# EAGLE design 3M_Repair (EAGLE 9.5.1)
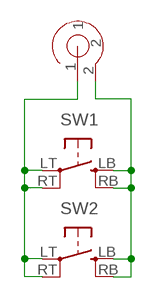
[diagram p0: schematic, sheet 1]

## Parts
P1  3M_PR  [3M_PR]
SW1  PUSH_BUTTON6X6  [6X6]
SW2  PUSH_BUTTON12X12  [12X12]

## Nets
N$1: P1.2 SW1.LB SW1.RB SW2.LB SW2.RB
N$2: P1.1 SW1.LT SW1.RT SW2.LT SW2.RT

## Library data of the parts
P1 = 3M_Piranha_Repair:3M_PR
SW1 SW2 = Eletromechanical > Switches > Tactile Switches:PUSH_BUTTON

## Board
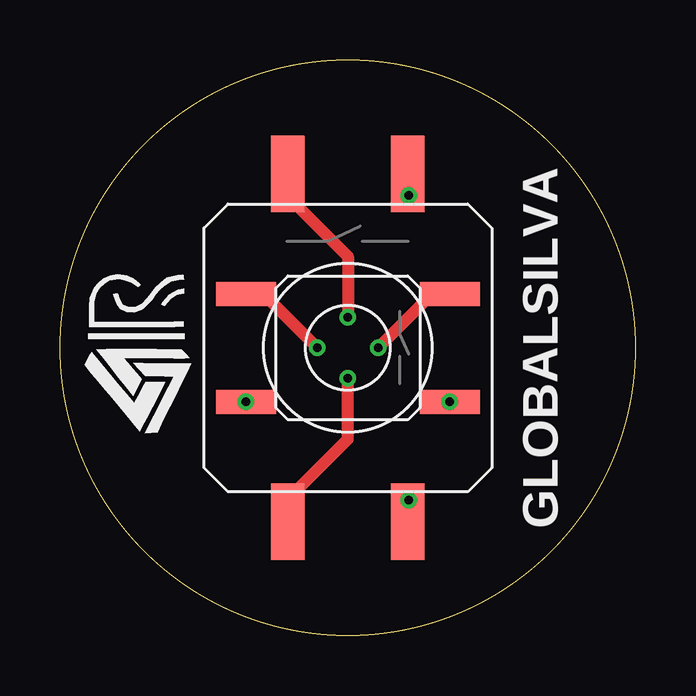
[diagram p1: board, top side]
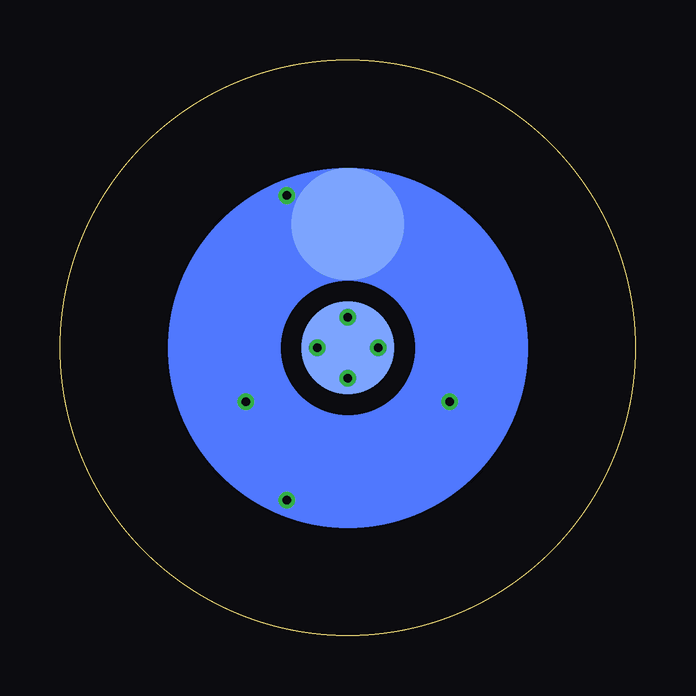
[diagram p2: board, bottom side, seen from below]

Size 24 x 24 mm. Coordinates in mm from the lower left corner, seen from the top.
Outline: circle at 12,12 radius 12
Copper layers (1*16): Top 0.035mm / dielectric 1.2mm / Bottom 0.035mm
Design rules "jlcpcb-2l-dr": minimum track width 5mil, minimum drill 0.3mm, track to track 5mil, track to pad 5mil, pad to pad 5mil, via to via 5mil, smd to smd 5mil, copper to edge 0.2mm, drill to drill 5mil, minimum pad ring 3mil, minimum via ring 3mil, stop-mask expansion 4mil, vias tented up to drill 0.5mm, thermal gap 10mil

### Footprints (pad centres in the part's own frame; a part is rotated, then mirrored left to right if it is on the bottom)
3M_PR = smd 3.85 x 3.85: 1 0,0 | smd 4.7 x 4.7: 2 0,5.15
6X6 = smd 2.5 x 1: LB -4.25,-2.25; LT -4.25,2.25; RB 4.25,-2.25; RT 4.25,2.25
12X12 = smd 3.2 x 1.4: LB -7.25,-2.5; LT -7.25,2.5; RB 7.25,-2.5; RT 7.25,2.5

### Placement (x,y rotation side)
P1  12,12 0 bottom
SW1  12,12 0 top
SW2  12,12 90 top
U$1  [RAFAEL_SILVA_5MM_ALT_3]  3.49,9.21 90 top

### Tracks (layer width: path | path; a pad name or v marks a point on that pad's centre or on a via)
N$1  (via drill 0.35)
  Top 0.5: SW2.RB 14.54,19.21 v14.54,18.35 | SW2.LB 14.5,5.61 v14.54,5.65
  Bottom 0.5: P1.2 16.25,12.9 SW1.RB 14.54,8.04 v14.54,5.65 | v14.54,18.35 13.34,17.15 P1.2 | SW1.LB 7.75,12.9 P1.2
  other vias: 16.25,9.75 7.75,9.75
N$2  (via drill 0.35)
  Top 0.5: SW2.LT 9.5,5.69 12,8.19 v12,10.73 | SW1.LT 8.48,14.25 v10.73,12 | SW1.RT 15.52,14.25 v13.27,12 | SW2.RT 9.5,18.31 12,15.81 v12,13.27
  Bottom 0.5: v10.73,12 P1.1 | P1.1 v13.27,12 | v12,13.27 P1.1 | v12,10.73 P1.1

### Text on the board
tPlace: GLOBALSILVA